# EAGLE design gps (EAGLE 7.3.0)
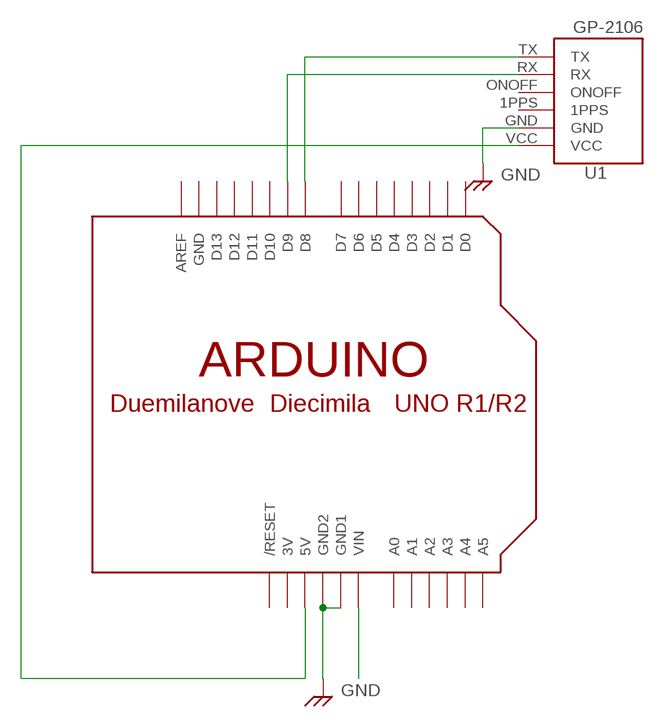
[diagram p0: schematic, sheet 1]

## Parts
U1  GP-2106  [GP-2106]
U$1  ARDUINO-NOHOLE  [ARDUINO-NOHOLE]

## Nets
GND: U1.GND U$1.GND1 U$1.GND2
N$6: U1.VCC U$1.5V
N$7: U1.TX U$1.D8
N$8: U1.RX U$1.D9
N$64: U$1.VIN
Unconnected: U1.1PPS U1.ONOFF U$1.A0 U$1.A1 U$1.A2 U$1.A3 U$1.A4 U$1.A5 U$1.AREF U$1.D0 U$1.D1 U$1.D2 U$1.D3 U$1.D4 U$1.D5 U$1.D6 U$1.D7 U$1.D10 U$1.D11 U$1.D12 U$1.D13 U$1.RESET(/RESET)

## Power pins joined to a net without a drawn wire
3V: U$1.3V
GND: U$1.GND

## Library data of the parts
U1 = SparkFun-RF:GP-2106: GP-2106 GPS SiRF IV
U$1 = adafruit:ARDUINO: Arduino Diecimila/Duemilanove Make a shield with ease, this package has all the named pins as well as the two mounting drill holes and an outline of the USB and DC power connector. The outline is on the DIMENSION layer, so if your board house uses it they will cut the outline to match. http://www.ladyada.net/library/pcb/eaglelibrary.html

## Board
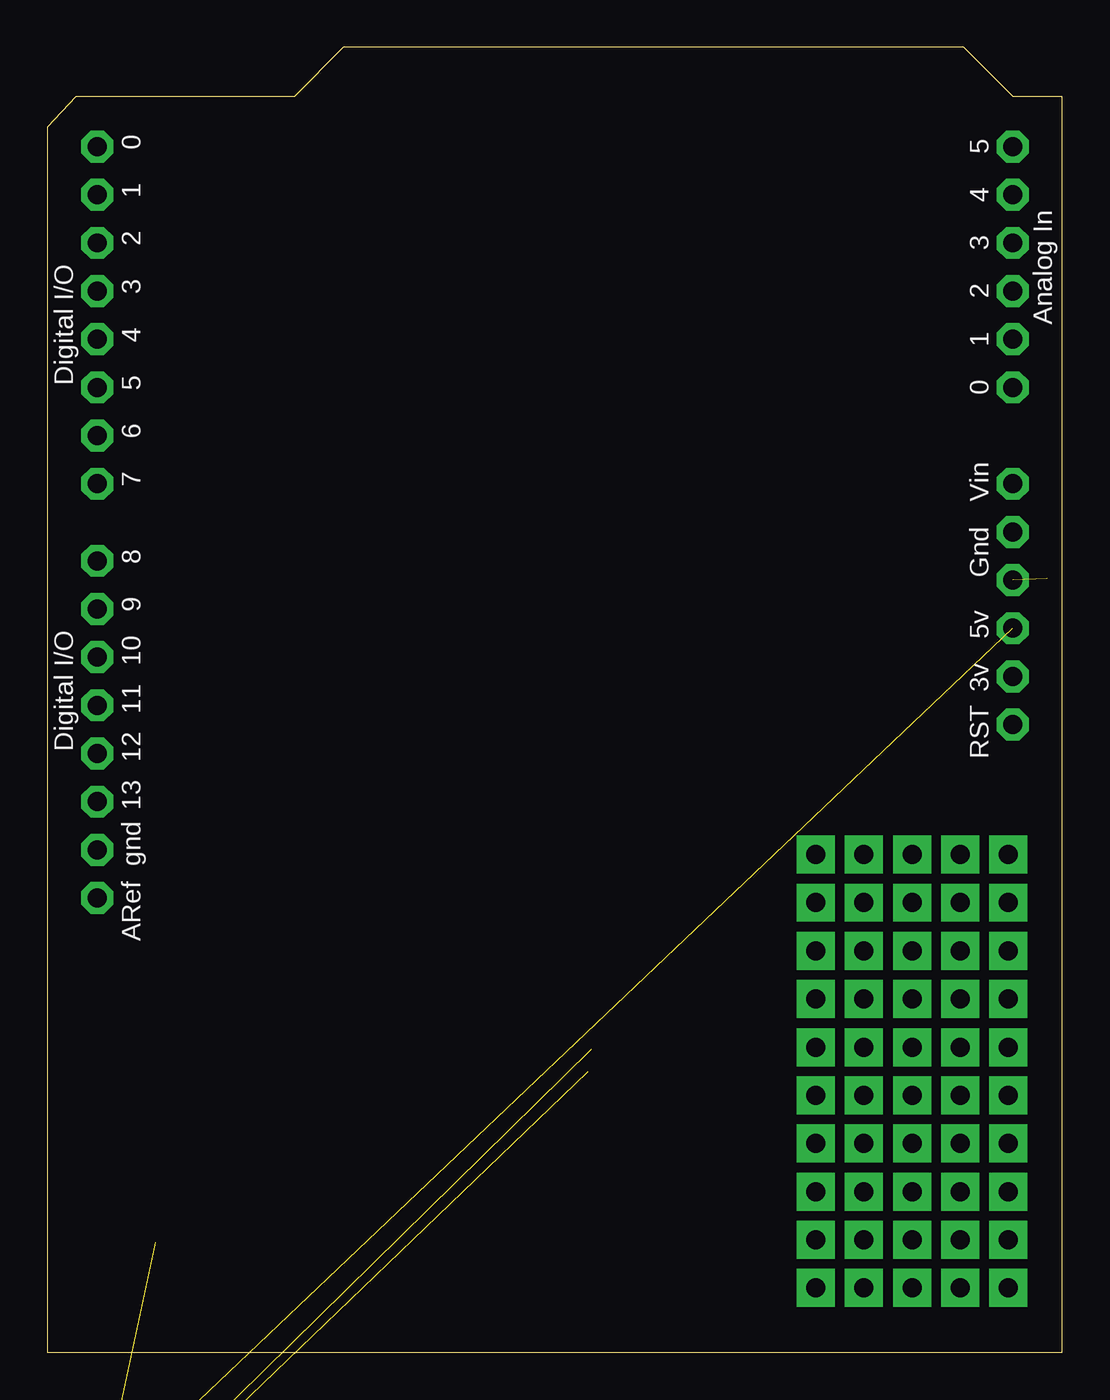
[diagram p1: board, top side]
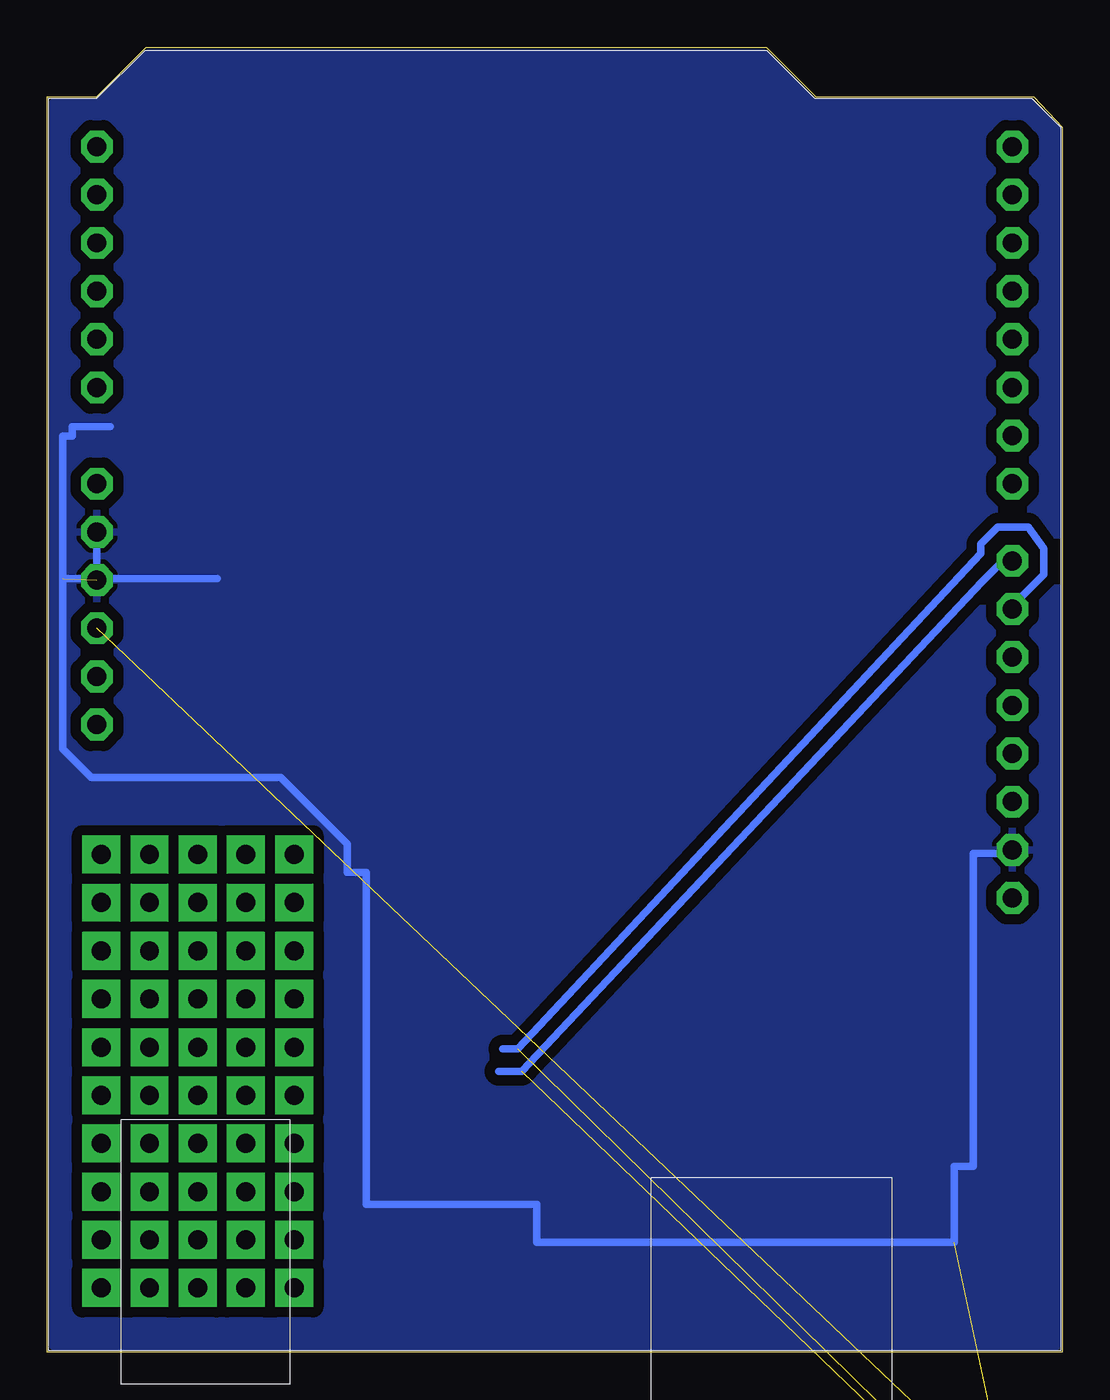
[diagram p2: board, bottom side, seen from below]

Size 53.5 x 68.8 mm. Coordinates in mm from the lower left corner, seen from the top.
Outline: 53.5,0 53.5,66.2 50.9,66.2 48.3,68.8 15.6,68.8 13,66.2 1.5,66.2 0,64.6 0,0 53.5,0
Copper layers (1*16): Top 0.035mm / dielectric 1.5mm / Bottom 0.035mm
Design rules "default *": minimum track width 10mil, minimum drill 24mil, track to track 8mil, track to pad 8mil, pad to pad 8mil, via to via 8mil, smd to smd 8mil, copper to edge 0mil, drill to drill 8mil, minimum pad ring 10mil, minimum via ring 8mil, stop-mask expansion 4mil, vias tented up to drill 0mil, thermal gap 10mil

### Footprints (pad centres in the part's own frame; a part is rotated, then mirrored left to right if it is on the bottom)
GP-2106 = smd 0.3 x 0.8: 1PPS -0.25,0; GND -0.75,0; ONOFF 0.25,0; RX 0.75,0; TX 1.25,0; VCC -1.25,0 | smd 0.4 x 0.8: P$7 -2.25,-2.5; P$8 2.25,-2.5
ARDUINO-NOHOLE = drill 1 pad 1.676 octagon: 3V 35.56,2.54; 5V 38.1,2.54; A0 50.8,2.54; A1 53.34,2.54; A2 55.88,2.54; A3 58.42,2.54; A4 60.96,2.54; A5 63.5,2.54; AREF 23.876,50.8; D0 63.5,50.8; D1 60.96,50.8; D2 58.42,50.8; D3 55.88,50.8; D4 53.34,50.8; D5 50.8,50.8; D6 48.26,50.8; D7 45.72,50.8; D8 41.656,50.8; D9 39.116,50.8; D10 36.576,50.8; D11 34.036,50.8; D12 31.496,50.8; D13 28.956,50.8; GND 26.416,50.8; GND1 43.18,2.54; GND2 40.64,2.54; RESET 33.02,2.54; VIN 45.72,2.54

### Placement (x,y rotation side)
U1  3.5,-8 0 top  (outside the outline)
U$1  53.43,0.07 90 top

### Tracks (layer width: path | path; a pad name or v marks a point on that pad's centre or on a via)
GND  (2 unrouted)
  Bottom 0.406: U$1.GND1 U$1.GND2 | 44.54,40.8 52.7,40.8 | 52.7,40.8 52.7,48.3 52.2,48.3 52.2,48.8 50.2,48.8 | U$1.GND 2.63,26.3 4.7,26.3 4.7,9.8 5.7,9.8 5.7,5.8 27.7,5.8 27.7,7.8 36.7,7.8 36.7,25.3 37.7,25.3 37.7,26.8 41.2,30.3 51.2,30.3 52.7,31.8 52.7,40.8
  pour Bottom (isolate 0.55): 53.2,0.3 0.3,0.3 0.3,64.5 1.7,65.9 13.1,65.9 15.7,68.5 48.2,68.5 50.8,65.9 53.2,65.9
N$6  (1 unrouted)
N$7  (1 unrouted)
  Bottom 0.406: 29.7,14.8 28.5,14.8 4.21,40.63 3.19,41.67 U$1.D8
N$8  (1 unrouted)
  Bottom 0.406: 29.5,16 28.7,16 4.3,42.1 4.3,42.6 3.4,43.5 1.8,43.5 0.99,42.38 0.99,41.01 2.36,39.64 2.38,39.64 U$1.D9
N$12  (via drill 1 pad 2)
  other vias: 40.5,16.08
N$15  (via drill 1 pad 2)
  other vias: 40.5,18.62
N$16  (via drill 1 pad 2)
  other vias: 40.5,21.16
N$17  (via drill 1 pad 2)
  other vias: 40.5,23.7
N$18  (via drill 1 pad 2)
  other vias: 40.5,26.24
N$19  (via drill 1 pad 2)
  other vias: 43.04,16.08
N$20  (via drill 1 pad 2)
  other vias: 43.04,18.62
N$21  (via drill 1 pad 2)
  other vias: 43.04,21.16
N$22  (via drill 1 pad 2)
  other vias: 43.04,23.7
N$23  (via drill 1 pad 2)
  other vias: 43.04,26.24
N$24  (via drill 1 pad 2)
  other vias: 45.58,26.24
N$25  (via drill 1 pad 2)
  other vias: 45.58,23.7
N$26  (via drill 1 pad 2)
  other vias: 45.58,21.16
N$27  (via drill 1 pad 2)
  other vias: 45.58,18.62
N$28  (via drill 1 pad 2)
  other vias: 45.58,16.08
N$29  (via drill 1 pad 2)
  other vias: 48.12,16.08
N$30  (via drill 1 pad 2)
  other vias: 48.12,18.62
N$31  (via drill 1 pad 2)
  other vias: 48.12,21.16
N$32  (via drill 1 pad 2)
  other vias: 48.12,23.7
N$33  (via drill 1 pad 2)
  other vias: 48.12,26.24
N$34  (via drill 1 pad 2)
  other vias: 50.66,26.24
N$35  (via drill 1 pad 2)
  other vias: 50.66,23.7
N$36  (via drill 1 pad 2)
  other vias: 50.66,21.16
N$37  (via drill 1 pad 2)
  other vias: 50.66,18.62
N$38  (via drill 1 pad 2)
  other vias: 50.66,16.08
N$39  (via drill 1 pad 2)
  other vias: 50.66,13.54
N$40  (via drill 1 pad 2)
  other vias: 48.12,13.54
N$41  (via drill 1 pad 2)
  other vias: 45.58,13.54
N$42  (via drill 1 pad 2)
  other vias: 43.04,13.54
N$43  (via drill 1 pad 2)
  other vias: 40.5,13.54
N$44  (via drill 1 pad 2)
  other vias: 40.5,3.38
N$45  (via drill 1 pad 2)
  other vias: 43.04,11
N$46  (via drill 1 pad 2)
  other vias: 45.58,11
N$47  (via drill 1 pad 2)
  other vias: 48.12,11
N$48  (via drill 1 pad 2)
  other vias: 50.66,11
N$49  (via drill 1 pad 2)
  other vias: 50.66,3.38
N$50  (via drill 1 pad 2)
  other vias: 50.66,5.92
N$51  (via drill 1 pad 2)
  other vias: 50.66,8.46
N$52  (via drill 1 pad 2)
  other vias: 48.12,5.92
N$53  (via drill 1 pad 2)
  other vias: 48.12,3.38
N$54  (via drill 1 pad 2)
  other vias: 45.58,3.38
N$55  (via drill 1 pad 2)
  other vias: 45.58,5.92
N$56  (via drill 1 pad 2)
  other vias: 48.12,8.46
N$57  (via drill 1 pad 2)
  other vias: 45.58,8.46
N$58  (via drill 1 pad 2)
  other vias: 43.04,5.92
N$59  (via drill 1 pad 2)
  other vias: 43.04,8.46
N$60  (via drill 1 pad 2)
  other vias: 40.5,11
N$61  (via drill 1 pad 2)
  other vias: 40.5,8.46
N$62  (via drill 1 pad 2)
  other vias: 40.5,5.92
N$63  (via drill 1 pad 2)
  other vias: 43.04,3.38